# Altium schematic sheet [2] - TRACKPAD MODULE.SchDoc: [1] - TRACKPAD MODULE
size A3; Author: Sawyer Rempel; Revision: A; SheetNumber: 1; SheetTotal: 3
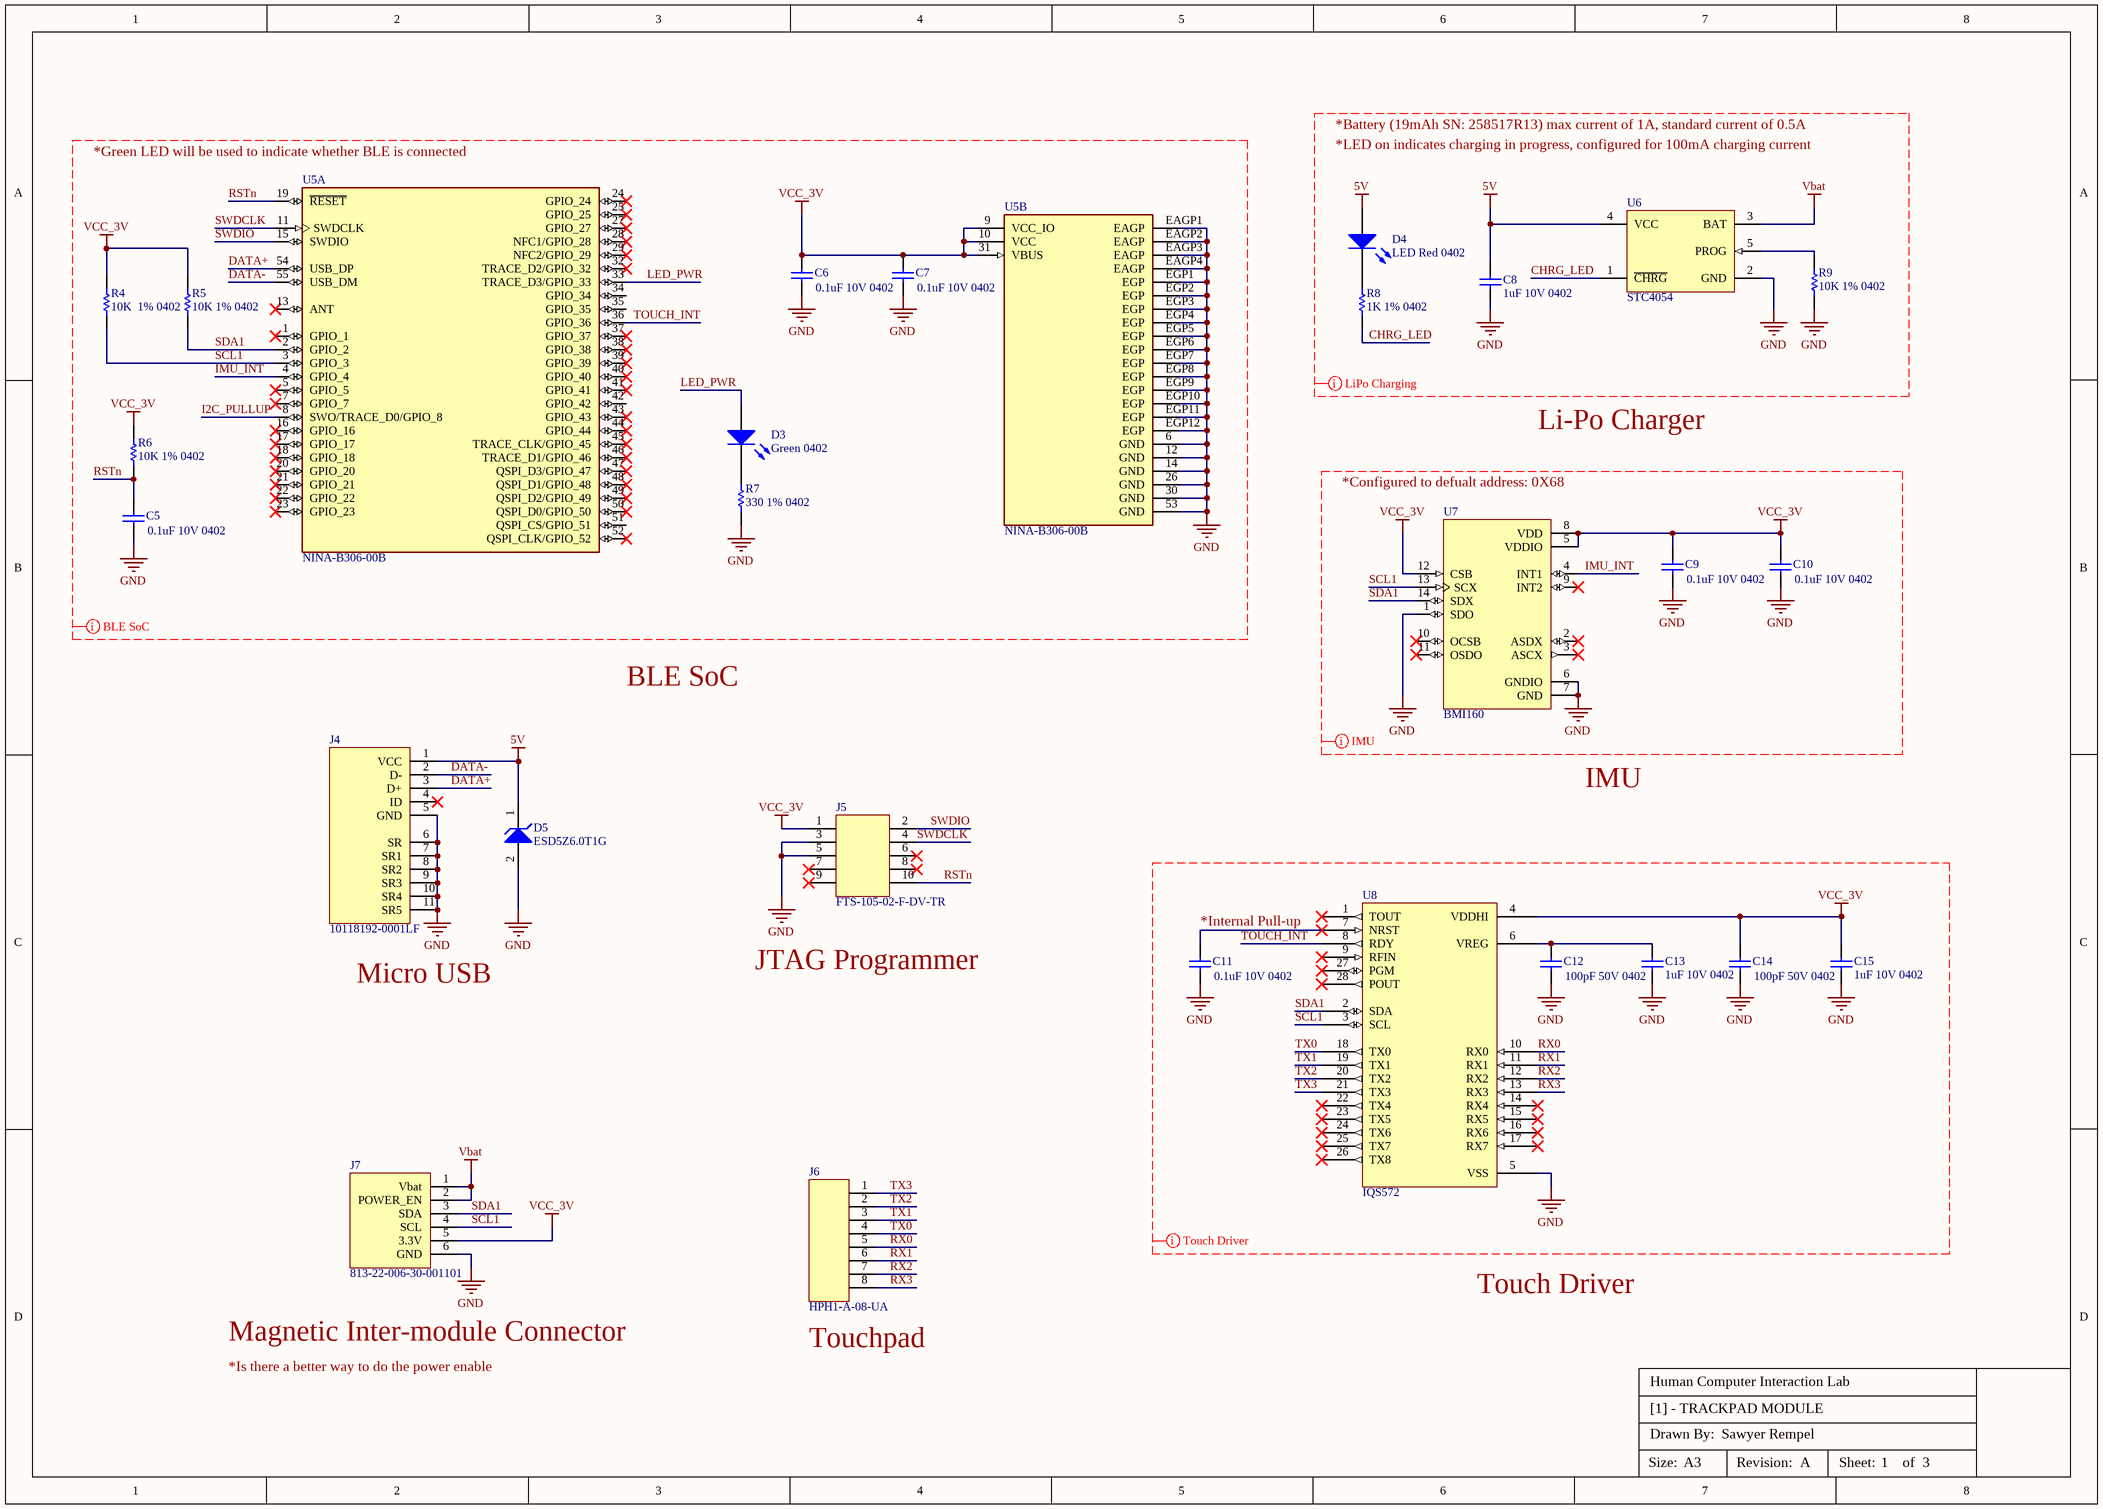
[diagram p0: [2] - TRACKPAD MODULE.SchDoc]

## Parts
C5  value 0.1uF 10V 0402  [0402 Capacitor]  (hidden comment: Cap)
C6  value 0.1uF 10V 0402  [0402 Capacitor]  (hidden comment: Cap)
C7  value 0.1uF 10V 0402  [0402 Capacitor]  (hidden comment: Cap)
C8  value 1uF 10V 0402  [0402 Capacitor]  (hidden comment: Cap)
C9  value 0.1uF 10V 0402  [0402 Capacitor]  (hidden comment: Cap)
C10  value 0.1uF 10V 0402  [0402 Capacitor]  (hidden comment: Cap)
C11  value 0.1uF 10V 0402  [0402 Capacitor]  (hidden comment: Cap)
C12  value 100pF 50V 0402  [0402 Capacitor]  (hidden comment: Cap)
C13  value 1uF 10V 0402  [0402 Capacitor]  (hidden comment: Cap)
C14  value 100pF 50V 0402  [0402 Capacitor]  (hidden comment: Cap)
C15  value 1uF 10V 0402  [0402 Capacitor]  (hidden comment: Cap)
D3  Green 0402  [0402 LED]
D4  LED Red 0402  [0402 LED]
D5  ESD5Z6.0T1G  [ONSC-SOD-523-2-502-01_V]
J4  10118192-0001LF  [10118192-0001LF]
J5  FTS-105-02-F-DV-TR  [FTS-105-02-F-DV-TR]
J6  HPH1-A-08-UA  [HPH1-A-08-UA]
J7  813-22-006-30-001101  [813-22-006-30-001101]
R4  value 10K  1% 0402  [0402 RESISTOR]  (hidden comment: Res1)
R5  value 10K 1% 0402  [0402 RESISTOR]  (hidden comment: Res1)
R6  value 10K 1% 0402  [0402 RESISTOR]  (hidden comment: Res1)
R7  value 330 1% 0402  [0402 RESISTOR]  (hidden comment: Res1)
R8  value 1K 1% 0402  [0402 RESISTOR]  (hidden comment: Res1)
R9  value 10K 1% 0402  [0402 RESISTOR]  (hidden comment: Res1)
U5  NINA-B306-00B  [NINA-B306-00B]  (parts A,B of 2)
U6  STC4054  [STC4054]
U7  BMI160  [BMI160]
U8  IQS572  [IQS572]

## Nets
5V: C8.1 D4.1(A) D5.1(K) J4.1(VCC) U6.4(VCC)
GND: C5.1 C6.1 C7.1 C8.2 C9.1 C10.1 C11.1 C12.1 C13.2 C14.1 C15.2 D5.2(A) J4.5(GND) J4.6(SR) J4.7(SR1) J4.8(SR2) J4.9(SR3) J4.10(SR4) J4.11(SR5) J5.3 J5.5 J7.6(GND) R7.2 R9.2 U5.6(GND) U5.12(GND) U5.14(GND) U5.26(GND) U5.30(GND) U5.53(GND) U5.EAGP1(EAGP) U5.EAGP2(EAGP) U5.EAGP3(EAGP) U5.EAGP4(EAGP) U5.EGP1(EGP) U5.EGP2(EGP) U5.EGP3(EGP) U5.EGP4(EGP) U5.EGP5(EGP) U5.EGP6(EGP) U5.EGP7(EGP) U5.EGP8(EGP) U5.EGP9(EGP) U5.EGP10(EGP) U5.EGP11(EGP) U5.EGP12(EGP) U6.2(GND) U7.1(SDO) U7.6(GNDIO) U7.7(GND) U8.5(VSS)
Vbat: J7.1(Vbat) J7.2(POWER_EN) U6.3(BAT)
VCC_3V: C6.2 C7.2 C9.2 C10.2 C14.2 C15.1 J5.1 J7.5(3.3V) R4.1 R5.1 R6.1 U5.9(VCC_IO) U5.10(VCC) U5.31(VBUS) U7.5(VDDIO) U7.8(VDD) U7.12(CSB) U8.4(VDDHI)
CHRG_LED: R8.2 U6.1(~{CHRG})
DATA+: J4.3(D+) U5.54(USB_DP)
DATA-: J4.2(D-) U5.55(USB_DM)
I2C_PULLUP: U5.8(SWO/TRACE_D0/GPIO_8)
IMU_INT: U5.4(GPIO_4) U7.4(INT1)
LED_PWR: D3.1(A) U5.33(TRACE_D3/GPIO_33)
RSTn: C5.2 J5.10 R6.2 U5.19(~{RESET})
RX0: J6.5 U8.10(RX0)
RX1: J6.6 U8.11(RX1)
RX2: J6.7 U8.12(RX2)
RX3: J6.8 U8.13(RX3)
SCL1: J7.4(SCL) R4.2 U5.3(GPIO_3) U7.13(SCX) U8.3(SCL)
SDA1: J7.3(SDA) R5.2 U5.2(GPIO_2) U7.14(SDX) U8.2(SDA)
SWDCLK: J5.4 U5.11(SWDCLK)
SWDIO: J5.2 U5.15(SWDIO)
TOUCH_INT: U5.36(GPIO_36) U8.8(RDY)
TX0: J6.4 U8.18(TX0)
TX1: J6.3 U8.19(TX1)
TX2: J6.2 U8.20(TX2)
TX3: J6.1 U8.21(TX3)
NetC11_2: C11.2 U8.7(NRST)
NetC12_2: C12.2 C13.1 U8.6(VREG)
NetD3_2: D3.2(K) R7.1
NetD4_2: D4.2(K) R8.1
NetR9_1: R9.1 U6.5(PROG)

Not connected (* = marked no-connect by the designer): J4 4(ID)*; J5 6* 7* 8* 9*; U5 1(GPIO_1)* 5(GPIO_5)* 7(GPIO_7)* 13(ANT)* 16(GPIO_16)* 17(GPIO_17)* 18(GPIO_18)* 20(GPIO_20)* 21(GPIO_21)* 22(GPIO_22)* 23(GPIO_23)* 24(GPIO_24)* 25(GPIO_25)* 27(GPIO_27)* 28(NFC1/GPIO_28)* 29(NFC2/GPIO_29)* 32(TRACE_D2/GPIO_32)* 34(GPIO_34) 35(GPIO_35) 37(GPIO_37)* 38(GPIO_38)* 39(GPIO_39)* 40(GPIO_40)* 41(GPIO_41)* 42(GPIO_42) 43(GPIO_43)* 44(GPIO_44)* 45(TRACE_CLK/GPIO_45)* 46(TRACE_D1/GPIO_46)* 47(QSPI_D3/GPIO_47)* 48(QSPI_D1/GPIO_48)* 49(QSPI_D2/GPIO_49)* 50(QSPI_D0/GPIO_50)* 51(QSPI_CS/GPIO_51) 52(QSPI_CLK/GPIO_52)*; U7 2(ASDX)* 3(ASCX)* 9(INT2)* 10(OCSB)* 11(OSDO)*; U8 1(TOUT)* 9(RFIN)* 14(RX4)* 15(RX5)* 16(RX6)* 17(RX7)* 22(TX4)* 23(TX5)* 24(TX6)* 25(TX7)* 26(TX8)* 27(PGM)* 28(POUT)*

## Layout directives
mark named LiPo Charging: 5V, CHRG_LED, GND, Vbat
mark named Touch Driver: GND, RX0, RX1, RX2, RX3, SCL1, SDA1, TOUCH_INT, TX0, TX1, TX2, TX3, VCC_3V
mark named IMU: GND, IMU_INT, SCL1, SDA1, VCC_3V
mark named BLE SoC: DATA+, DATA-, GND, I2C_PULLUP, IMU_INT, LED_PWR, RSTn, SCL1, SDA1, SWDCLK, SWDIO, TOUCH_INT, VCC_3V

## Notes on the sheet
- (near U5) *Green LED will be used to indicate whether BLE is connected
- *Battery (19mAh SN: 258517R13) max current of 1A, standard current of 0.5A
- *LED on indicates charging in progress, configured for 100mA charging current
- Li-Po Charger
- (near U7) *Configured to defualt address: 0X68
- BLE SoC
- IMU
- (near J4) Micro USB
- JTAG Programmer
- *Internal Pull-up
- Touch Driver
- Magnetic Inter-module Connector
- *Is there a better way to do the power enable
- (near J6) Touchpad
- Human Computer Interaction Lab
- Drawn By:
- Size:
- A3
- Revision:
- Sheet:
- of

## Library data of the parts
C5-C15 = Cap: Capacitor; Published: 8-Jun-2000; LatestRevisionDate: 17-Jul-2002; LatestRevisionNote: Re-released for DXP Platform.; Publisher: Altium Limited; PackageDescription: Radial Cap, Thru-Hole; 2 Leads; 0.3 in Pin Spacing; PackageReference: RAD-0.3
  C5-C7 C9-C11: Digikey PN: 1276-1022-1-ND
  C8 C13 C15: Digikey PN: 1276-1076-1-ND
  C12 C14: Digikey PN: 478-1089-1-ND
D3 D4 = LED1: Typical RED GaAs LED; Published: 8-Jun-2000; LatestRevisionDate: 08-Jul-2005; LatestRevisionNote: Mech Layer 1 removed.; PackageReference: LED-1; Publisher: Altium Limited; PackageDescription: LED; 2 Leads
  D3: Digikey PN: 754-1101-1-ND
  D4: Digikey PN: 754-1104-1-ND
D5 = CMP-1063-00101-1: Transient Voltage Suppressor, Micro-Packaged Diode for ESD Protection, 2-Pin SOD-523, Pb-Free, Tape and Reel; Manufacturer: On Semiconductor; PPK Max (W): 181; Direction: Unidirectional; Number of Lines: 1; V(BR) Min (V): 6.8; IR Max (uA): 0.01; VRWM Max (V): 6; Packing: Tape and Reel; PackageReference: SOD-523-2-502-01; Mounting Technology: Surface Mount; RoHS: Pb-Free; ComponentLink2Description: Datasheet; PackageVersion: Rev. E, 09/2010; ComponentLink2URL: http://www.onsemi.cn/pub_link/Collateral/ESD5Z2.5T1-D.PDF; PackageDescription: 2-Pin SOD, Body 1.2 x 0.8 mm; DatasheetVersion: Rev. 10; ComponentLink3Description: Package Specification; ComponentLink3URL: http://www.onsemi.com/pub_link/Collateral/502-01.PDF; ComponentLink1URL: http://www.onsemi.com/; ComponentLink1Description: Manufacturer URL; PartNumber: ESD5Z6.0T1G; Digikey PN: ESD5Z6.0T1GOSCT-ND
R4-R9 = Res1: Resistor; Published: 8-Jun-2000; LatestRevisionDate: 17-Jul-2002; LatestRevisionNote: Re-released for DXP Platform.; PackageReference: AXIAL-0.3; Publisher: Altium Limited; PackageDescription: Axial Device, Thru-Hole; 2 Leads; 0.3 in Pin Spacing
  R4-R6: Digikey PN: 311-10.0KLRCT-ND
  R7: Digikey PN: 311-330LRCT-ND
  R8 R9: Digikey PN: 311-1.00KLRCT-ND
J4 = 10118192-0001LF: Digikey PN: 609-4613-1-ND
J5 = FTS-105-02-F-DV-TR: Digikey PN: SAM13904CT-ND
J6 = HPH1-A-08-UA: Digikey PN: 2057-HPH1-A-08-UA-ND
J7 = 813-22-006-30-001101: Digikey PN: ED8131-06-ND
U5 = NINA-B306-00B: Digikey PN: 672-NINA-B306-00BCT-ND
U6 = STC4054: Digikey PN: 497-5809-1-ND
U7 = BMI160: Digikey PN: 828-1057-1-ND
U8 = IQS572: Supplier Part Number: 1790-1047-2-ND; Digikey PN: 1790-1047-1-ND